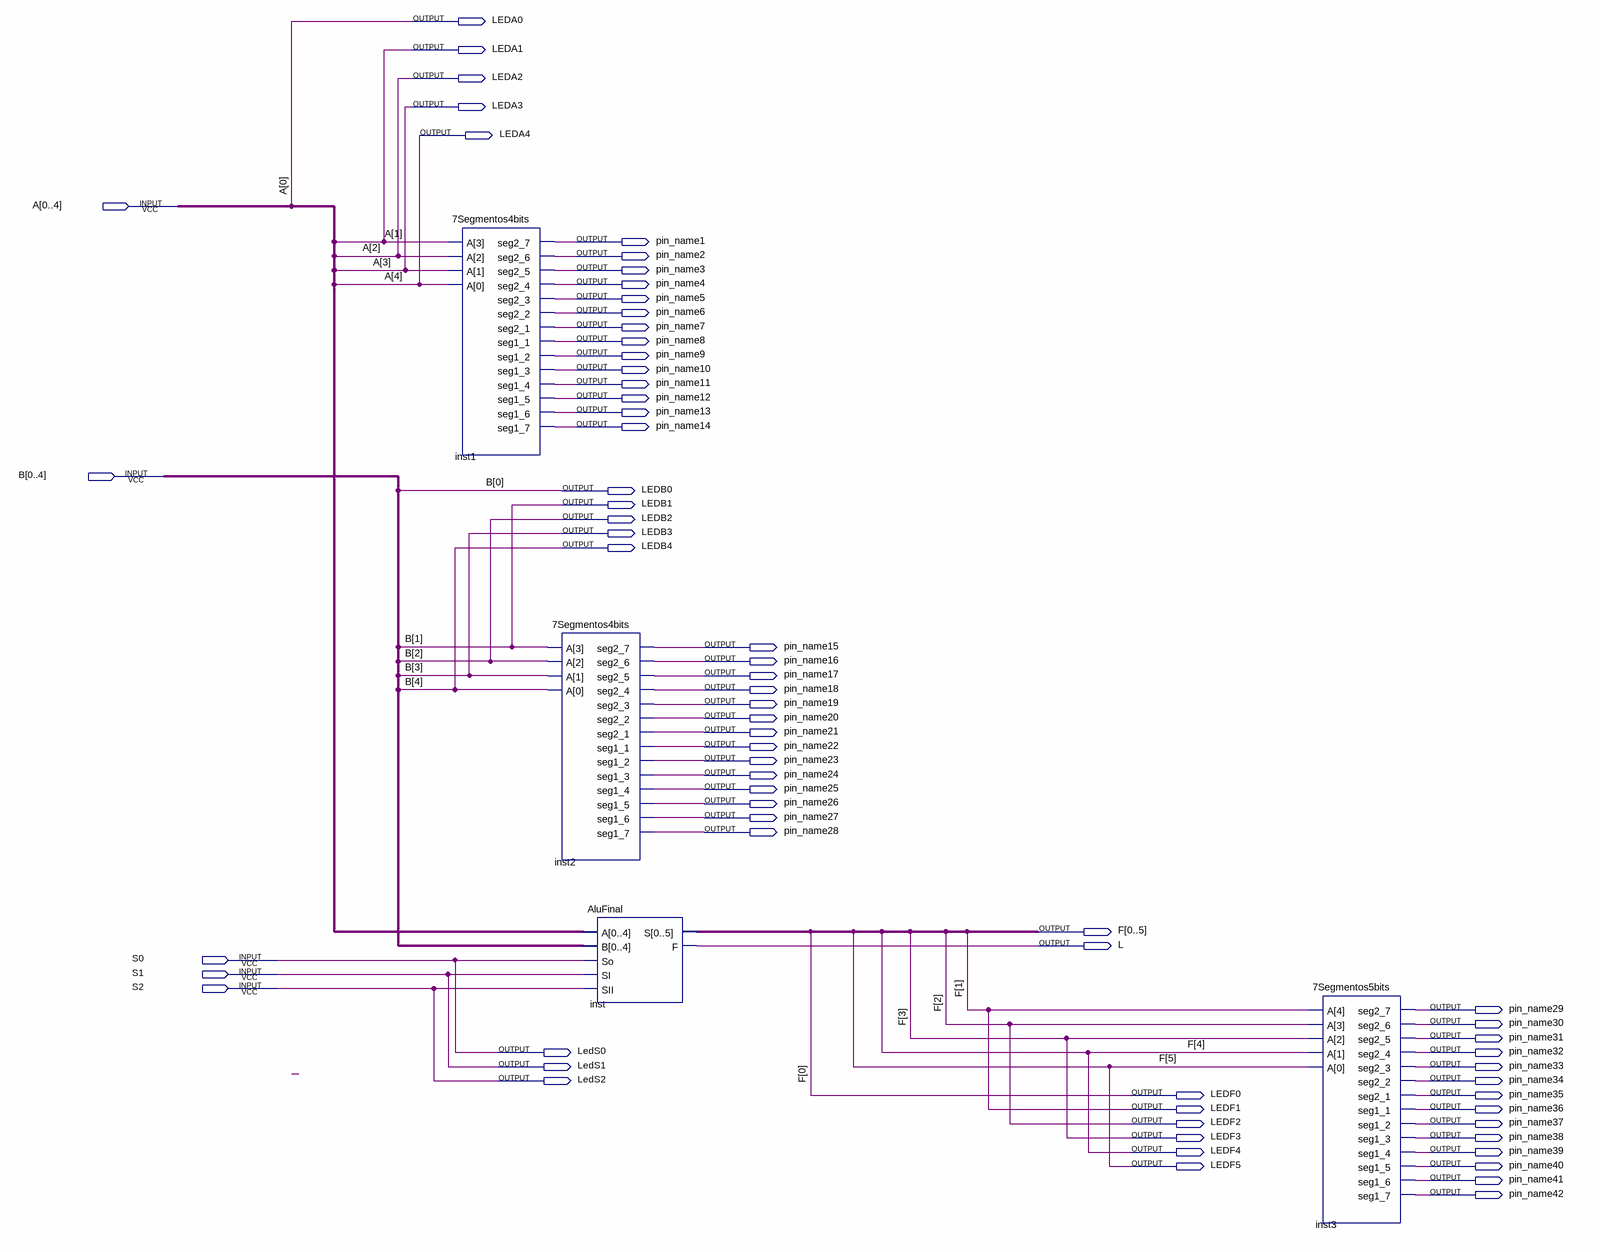
[diagram p0: schematic sheet]
// Quartus schematic CircuitoFinal.bdf as structural Verilog: 4 symbols, 68 pins
module CircuitoFinal (
  input  [0:4] A,
  input  [0:4] B,
  input  S0,
  input  S1,
  input  S2,
  output LEDA0,
  output LEDA1,
  output LEDA2,
  output LEDA3,
  output LEDA4,
  output pin_name1,
  output pin_name2,
  output pin_name3,
  output pin_name4,
  output pin_name5,
  output pin_name6,
  output pin_name7,
  output pin_name8,
  output pin_name9,
  output pin_name10,
  output pin_name11,
  output pin_name12,
  output pin_name13,
  output pin_name14,
  output LEDB0,
  output LEDB1,
  output LEDB2,
  output LEDB3,
  output LEDB4,
  output pin_name15,
  output pin_name16,
  output pin_name17,
  output pin_name18,
  output pin_name19,
  output pin_name20,
  output pin_name21,
  output pin_name22,
  output pin_name23,
  output pin_name24,
  output pin_name25,
  output pin_name26,
  output pin_name27,
  output pin_name28,
  output [0:5] F,
  output L,
  output pin_name29,
  output pin_name30,
  output pin_name31,
  output LedS0,
  output pin_name32,
  output LedS1,
  output pin_name33,
  output LedS2,
  output pin_name34,
  output LEDF0,
  output pin_name35,
  output LEDF1,
  output pin_name36,
  output LEDF2,
  output pin_name37,
  output LEDF3,
  output pin_name38,
  output LEDF4,
  output pin_name39,
  output LEDF5,
  output pin_name40,
  output pin_name41,
  output pin_name42
);

  \7Segmentos4bits  inst1 (
    .A(A[1:4]), .seg2_7(pin_name1), .seg2_6(pin_name2), .seg2_5(pin_name3), .seg2_4(pin_name4),
    .seg2_3(pin_name5), .seg2_2(pin_name6), .seg2_1(pin_name7), .seg1_1(pin_name8), .seg1_2(pin_name9),
    .seg1_3(pin_name10), .seg1_4(pin_name11), .seg1_5(pin_name12), .seg1_6(pin_name13), .seg1_7(pin_name14));
  \7Segmentos4bits  inst2 (
    .A(B[1:4]), .seg2_7(pin_name15), .seg2_6(pin_name16), .seg2_5(pin_name17), .seg2_4(pin_name18),
    .seg2_3(pin_name19), .seg2_2(pin_name20), .seg2_1(pin_name21), .seg1_1(pin_name22), .seg1_2(pin_name23),
    .seg1_3(pin_name24), .seg1_4(pin_name25), .seg1_5(pin_name26), .seg1_6(pin_name27), .seg1_7(pin_name28));
  AluFinal inst (.A(A), .B(B), .So(S0), .SI(S1), .SII(S2), .S(F), .F(L));
  \7Segmentos5bits  inst3 (
    .A(F[1:5]), .seg2_7(pin_name29), .seg2_6(pin_name30), .seg2_5(pin_name31), .seg2_4(pin_name32),
    .seg2_3(pin_name33), .seg2_2(pin_name34), .seg2_1(pin_name35), .seg1_1(pin_name36), .seg1_2(pin_name37),
    .seg1_3(pin_name38), .seg1_4(pin_name39), .seg1_5(pin_name40), .seg1_6(pin_name41), .seg1_7(pin_name42));

  assign LEDA0 = A[0];
  assign LEDA1 = A[1];
  assign LEDA2 = A[2];
  assign LEDA3 = A[3];
  assign LEDA4 = A[4];
  assign LEDB0 = B[0];
  assign LEDB1 = B[1];
  assign LEDB2 = B[2];
  assign LEDB3 = B[3];
  assign LEDB4 = B[4];
  assign LEDF0 = F[0];
  assign LEDF1 = F[1];
  assign LEDF2 = F[2];
  assign LEDF3 = F[3];
  assign LEDF4 = F[4];
  assign LEDF5 = F[5];
  assign LedS0 = S0;
  assign LedS1 = S1;
  assign LedS2 = S2;
endmodule
